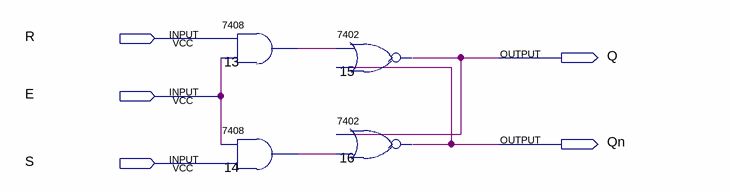
[diagram p0: schematic sheet]
// Quartus schematic Problem3.bdf as structural Verilog: 4 symbols, 5 pins
module Problem3 (
  input  R,
  input  E,
  input  S,
  output Q,
  output Qn
);

  wire n13_1, n14_1;

  \7408  u_13 (.\3 (E), .\2 (R), .\1 (n13_1));
  \7408  u_14 (.\3 (S), .\2 (E), .\1 (n14_1));
  \7402  u_15 (.\2 (n13_1), .\3 (Qn), .\1 (Q));
  \7402  u_16 (.\2 (Q), .\3 (n14_1), .\1 (Qn));
endmodule
